# Altium schematic sheet AUDIO_1.SchDoc: Air724UG 参考设计
size 594 x 419 mm; DESIGNER: Loukanghua; REV: V1.0
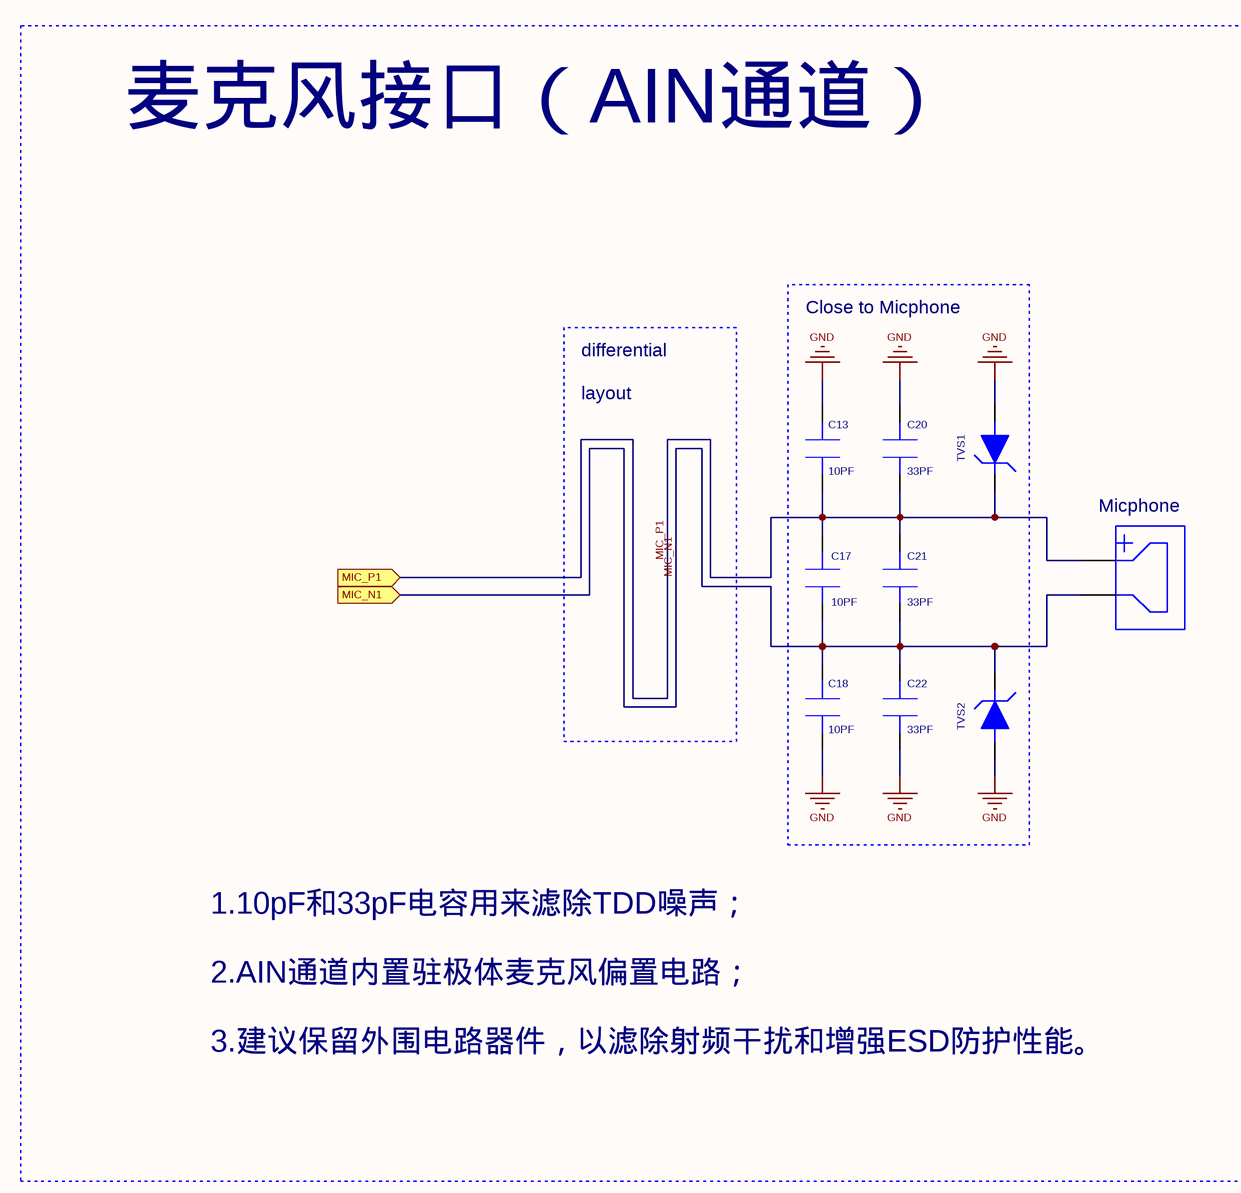
[diagram p0: AUDIO_1.SchDoc, top left]
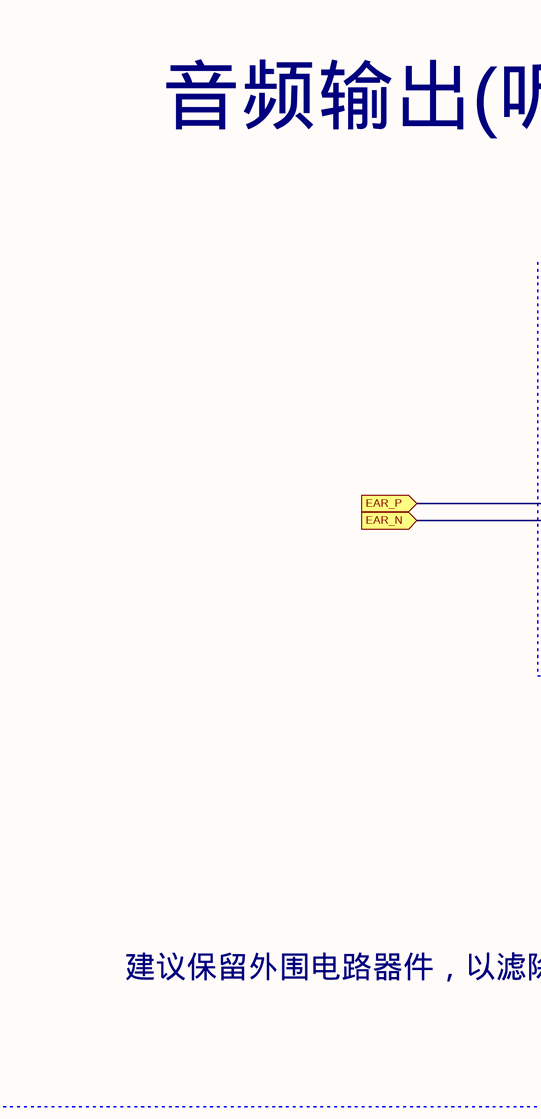
[diagram p1: AUDIO_1.SchDoc, top middle]
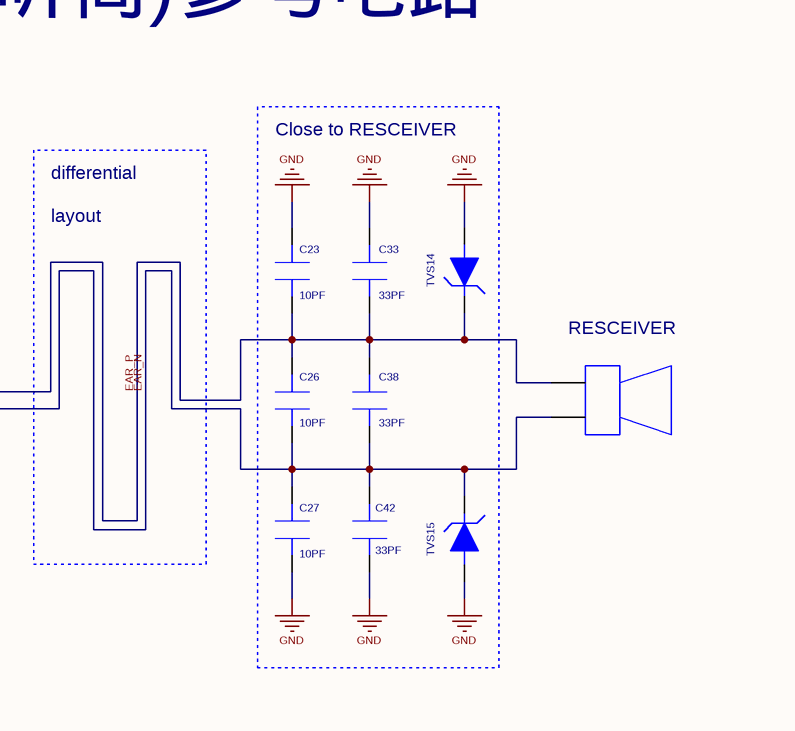
[diagram p2: AUDIO_1.SchDoc, top right]
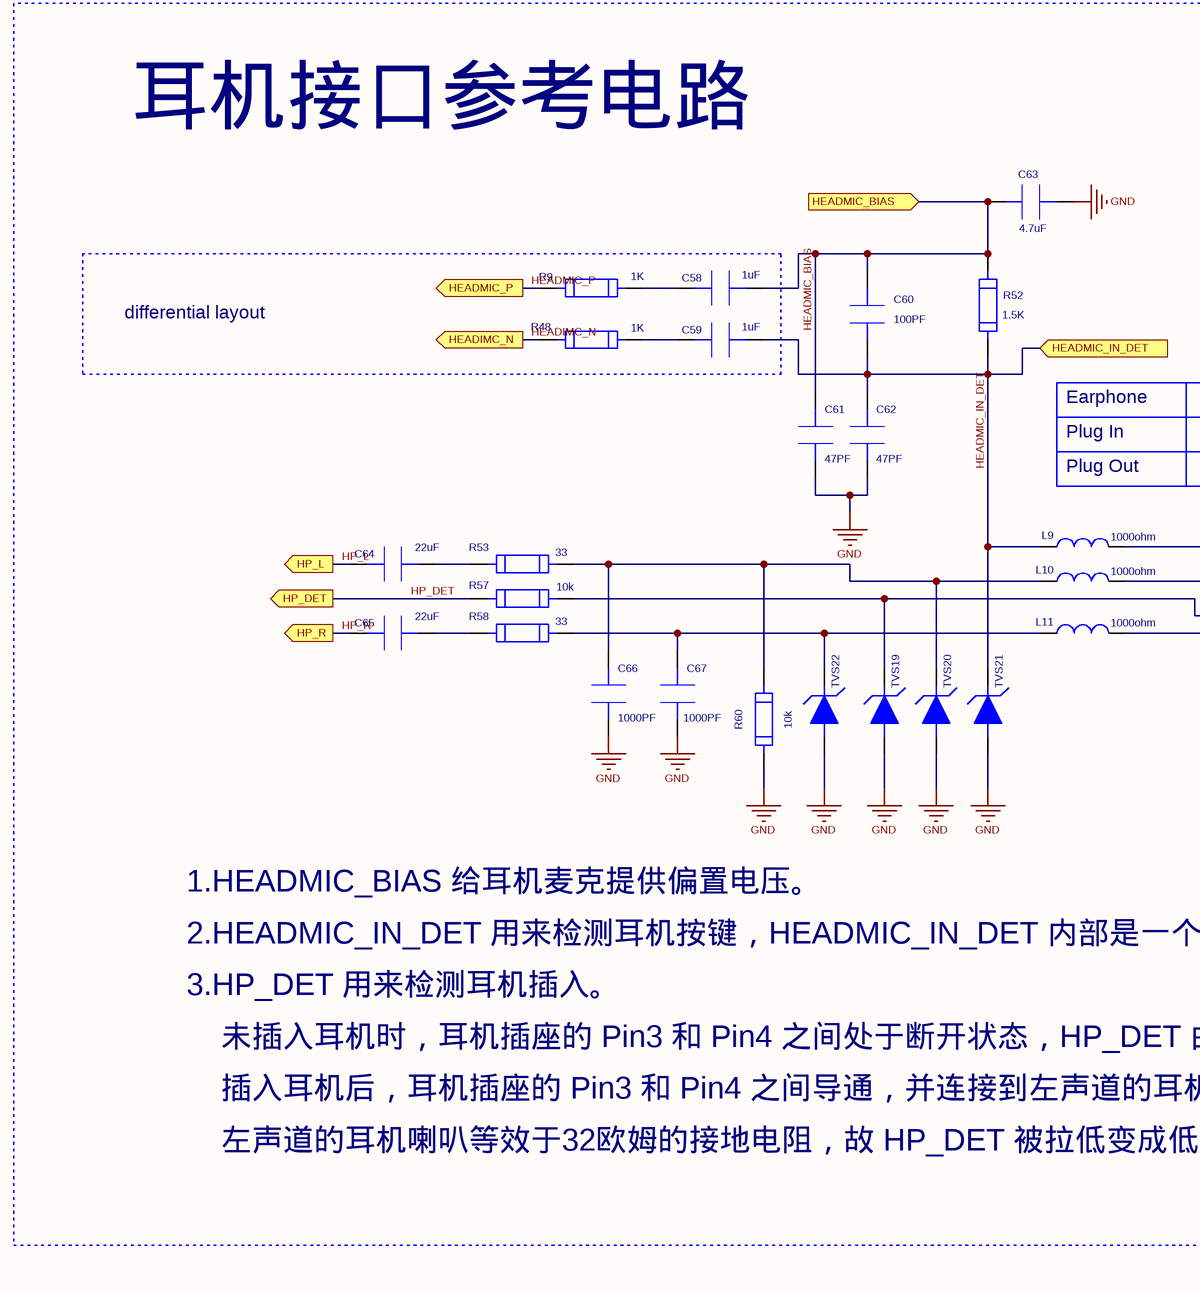
[diagram p3: AUDIO_1.SchDoc, bottom left]
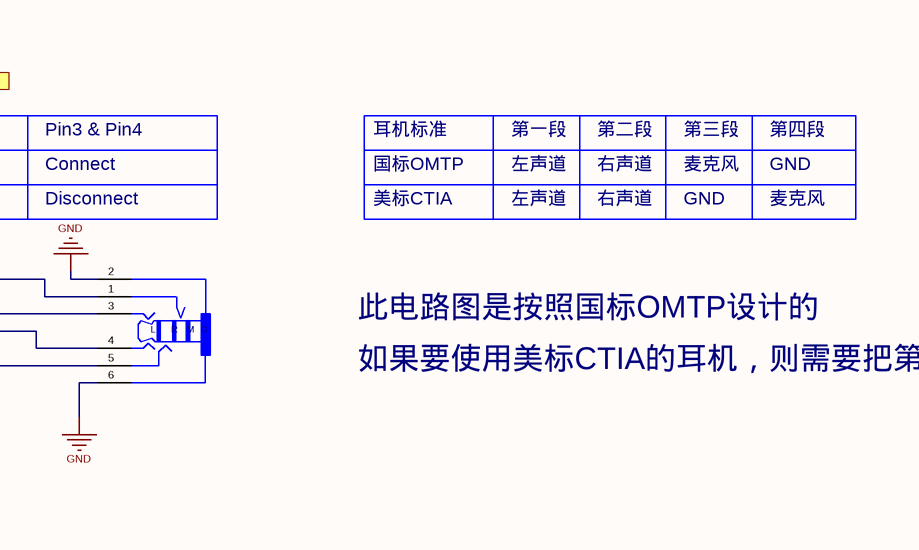
[diagram p4: AUDIO_1.SchDoc, bottom middle]
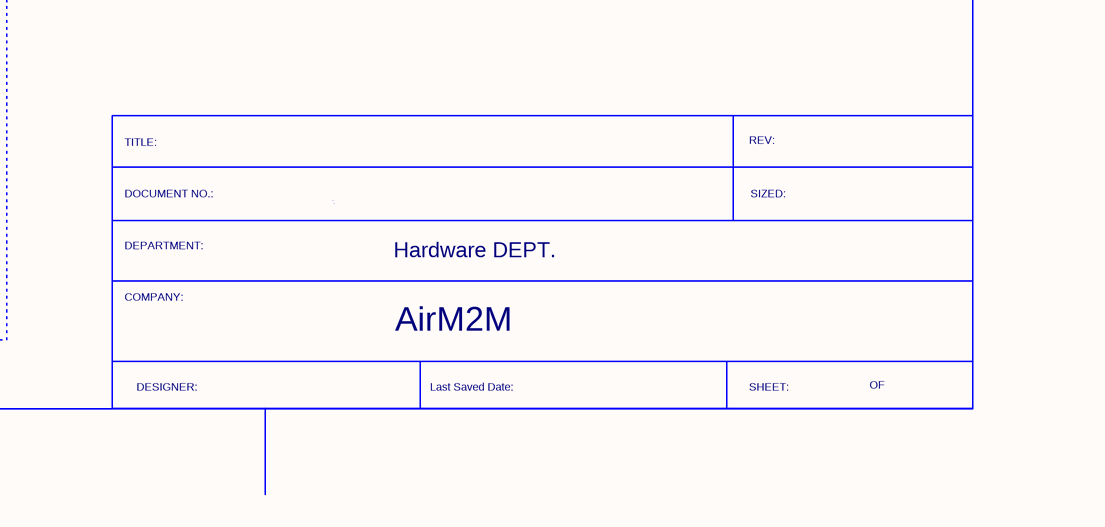
[diagram p5: AUDIO_1.SchDoc, bottom right]

## Parts
C13  value 10PF  [SC0201]  (hidden comment: CAP-10PF-0201-COG)
C17  value 10PF  [SC0201]  (hidden comment: CAP-10PF-0201-COG)
C18  value 10PF  [SC0201]  (hidden comment: CAP-10PF-0201-COG)
C20  value 33PF  [SC0201]  (hidden comment: CAP-10PF-0201-COG)
C21  value 33PF  [SC0201]  (hidden comment: CAP-10PF-0201-COG)
C22  value 33PF  [SC0201]  (hidden comment: CAP-10PF-0201-COG)
C23  value 10PF  [SC0201]  (hidden comment: CAP-10PF-0201-COG)
C26  value 10PF  [SC0201]  (hidden comment: CAP-10PF-0201-COG)
C27  value 10PF  [SC0201]  (hidden comment: CAP-10PF-0201-COG)
C33  value 33PF  [SC0201]  (hidden comment: CAP-10PF-0201-COG)
C38  value 33PF  [SC0201]  (hidden comment: CAP-10PF-0201-COG)
C42  value 33PF  [SC0201]  (hidden comment: CAP-10PF-0201-COG)
C58  value 1uF  [SC0402]  (hidden comment: CAP-1UF-0402-X5R)
C59  value 1uF  [SC0402]  (hidden comment: CAP-1UF-0402-X5R)
C60  value 100PF  [SC0402]  (hidden comment: CAP-100PF-0402-C0G)
C61  value 47PF  [SC0402]  (hidden comment: CAP-47PF-0402-C0G)
C62  value 47PF  [SC0402]  (hidden comment: CAP-47PF-0402-C0G)
C63  value 4.7uF  [SC0402]  (hidden comment: CAP-4.7UF-6.3V-0402)
C64  value 22uF  [SC0402]  (hidden comment: CAP-10UF-6.3V-0402)
C65  value 22uF  [SC0402]  (hidden comment: CAP-10UF-6.3V-0402)
C66  value 1000PF  [SC0402]  (hidden comment: CAP-1000PF-0402-X7R)
C67  value 1000PF  [SC0402]  (hidden comment: CAP-1000PF-0402-X7R)
J3  AUDIO-SUGGEST-1  [AUDIO-EAR-DA0635180-1208-A]  (value not drawn)
J5  AUDIO-SPEAKER-BLUEHY  [CON2-2]  (value not drawn)
L9  value 1000ohm  [SL0402]  (hidden comment: BEAD-1000OHM-0402)
L10  value 1000ohm  [SL0402]  (hidden comment: BEAD-1000OHM-0402)
L11  value 1000ohm  [SL0402]  (hidden comment: BEAD-1000OHM-0402)
M1  AUDIO-MIC-BLUEHY  [CON2-2/3]  (value not drawn)
R9  value 1K  [SR0402]  (hidden comment: RES-1K-0402)
R48  value 1K  [SR0402]  (hidden comment: RES-1K-+-1%-0402)
R52  value 1.5K  [SR0402]  (hidden comment: RES-1.2K-0402)
R53  value 33  [SR0402]  (hidden comment: RES-33-0402)
R57  value 10k  [SR0402]  (hidden comment: RES-10K-0402)
R58  value 33  [SR0402]  (hidden comment: RES-33-0402)
R60  value 10k  [SR0402]  (hidden comment: RES-10K-0402)
TVS1  ESD-TVS-ESD9X5.0ST5G  [SOD-923-ESD9X5.0ST5G]  (value not drawn)
TVS2  ESD-TVS-ESD9X5.0ST5G  [SOD-923-ESD9X5.0ST5G]  (value not drawn)
TVS14  ESD-TVS-ESD9X5.0ST5G  [SOD-923-ESD9X5.0ST5G]  (value not drawn)
TVS15  ESD-TVS-ESD9X5.0ST5G  [SOD-923-ESD9X5.0ST5G]  (value not drawn)
TVS19  ESD-TVS-ESD5Z5.0T1_A  [SOD523(ESD5Z5.0T1)]  (value not drawn)
TVS20  ESD-TVS-ESD5Z5.0T1_A  [SOD523(ESD5Z5.0T1)]  (value not drawn)
TVS21  ESD-TVS-ESD5Z5.0T1_A  [SOD523(ESD5Z5.0T1)]  (value not drawn)
TVS22  ESD-TVS-ESD5Z5.0T1_A  [SOD523(ESD5Z5.0T1)]  (value not drawn)

## Blocks framed on the sheet
麦克风接口（AIN通道）: M1
音频输出(听筒)参考电路: J5
Close to Micphone: C13 C17 C18 C20-C22 TVS1 TVS2
Close to RESCEIVER: C23 C26 C27 C33 C38 C42 TVS14 TVS15
耳机接口参考电路: C60-C67 J3 L9-L11 R52 R53 R57 R58 R60 TVS19-TVS22
differential layout: C58 C59 R9 R48

## Ports
EAR_N, EAR_P, HEADIMC_N (out), HEADMIC_BIAS, HEADMIC_IN_DET, HEADMIC_P (out), HP_DET (out), HP_L (out), HP_R (out), MIC_N1, MIC_P1

## Nets
GND: C13.1 C18.2 C20.1 C22.2 C23.1 C27.2 C33.1 C42.2 C61.2 C62.2 C63.2 C66.2 C67.2 J3.2 J3.6 R60.1 TVS1.2 TVS2.2 TVS14.2 TVS15.2 TVS19.2 TVS20.2 TVS21.2 TVS22.2
EAR_N: C26.2 C27.1 C38.2 C42.1 J5.2 TVS15.1 ; port EAR_N
EAR_P: C23.2 C26.1 C33.2 C38.1 J5.1 TVS14.1 ; port EAR_P
HEADIMC_N: R48.1 ; port HEADIMC_N
HEADMIC_BIAS: C58.2 C60.1 C61.1 C63.1 R52.2 ; port HEADMIC_BIAS
HEADMIC_IN_DET: C59.2 C60.2 C62.1 L9.1 R52.1 TVS21.1 ; port HEADMIC_IN_DET
HEADMIC_P: R9.1 ; port HEADMIC_P
HP_DET: R57.1 ; port HP_DET
HP_L: C64.1 ; port HP_L
HP_R: C65.1 ; port HP_R
MIC_N1: C17.2 C18.1 C21.2 C22.1 M1.2 TVS2.1 ; port MIC_N1
MIC_P1: C13.2 C17.1 C20.2 C21.1 M1.1 TVS1.1 ; port MIC_P1
NetC58_1: C58.1 R9.2
NetC59_1: C59.1 R48.2
NetC64_2: C64.2 R53.1
NetC65_2: C65.2 R58.1
NetC66_1: C66.1 L10.1 R53.2 R60.2 TVS20.1
NetC67_1: C67.1 L11.1 R58.2 TVS22.1
NetJ3_1: J3.1 L9.2
NetJ3_3: J3.3 L10.2
NetJ3_4: J3.4 R57.2 TVS19.1
NetJ3_5: J3.5 L11.2

## Notes on the sheet
- differential
- layout
- (near M1) Micphone
- (near J5) RESCEIVER
- 1.10pF和33pF电容用来滤除TDD噪声；
- 2.AIN通道内置驻极体麦克风偏置电路；
- 3.建议保留外围电路器件，以滤除射频干扰和增强ESD防护性能。
- 建议保留外围电路器件，以滤除射频干扰和增强ESD防护性能。
- Earphone
- Pin3 & Pin4
- 耳机标准
- 第一段
- 第二段
- 第三段
- 第四段
- Plug In
- Plug Out
- Connect
- Disconnect
- 国标OMTP
- 美标CTIA
- 左声道
- 右声道
- 麦克风
- GND
- 此电路图是按照国标OMTP设计的
- 如果要使用美标CTIA的耳机，则需要把第3段、第4段的接线对换一下。
- 1.HEADMIC_BIAS 给耳机麦克提供偏置电压。
- 2.HEADMIC_IN_DET 用来检测耳机按键，HEADMIC_IN_DET 内部是一个ADC，故 HEADMIC_IN_DET 还可以支持多功能按键。
- 3.HP_DET 用来检测耳机插入。
- 未插入耳机时，耳机插座的 Pin3 和 Pin4 之间处于断开状态，HP_DET 由内部拉高，为高电平。
- TITLE:
- REV:
- 插入耳机后，耳机插座的 Pin3 和 Pin4 之间导通，并连接到左声道的耳机喇叭。
- 左声道的耳机喇叭等效于32欧姆的接地电阻，故 HP_DET 被拉低变成低电平。
- DEPARTMENT:
- DOCUMENT NO.:
- Hardware DEPT.
- SIZED:
- COMPANY:
- AirM2M
- DESIGNER:
- Last Saved Date:
- SHEET:
- OF
- (in symbol AUDIO-SUGGEST-1) L; R; M; G

## Library data of the parts
C13 C17 C18 C20-C23 C26 C27 C33 C38 C42 = CAP-10PF-0201-COG: CAP CER C0G;10PF;+/-5%;25V;0201;0.35mm;ROHS; Manufacture 1: Eyang;; Manufacture 1 P/N: C0201C0G100J250NT; Serial Number: 80212640006; Geometry.Height: 0.35mm; Tolerance: +/-5%; PCB DECAL: SC0201
C58 C59 = CAP-1UF-0402-X5R: CAP CER X5R;1uF;+/-10%;6.3V;0402;0.5mm;ROHS; Manufacture 1 P/N: GRM155R60J105K****;CC0402KRX5R5BB105;C1005X5R0J105KT;JMK105BJ105KV-F;ECJ0EB0J105K;0402X105K6R3CT;CL05A105KQ5NNNC; Manufacture 1: Murata;Yageo;TDK;Taiyo Yuden;Panasonic;Walsin;Samsung; Serial Number: 80214710001; Geometry.Height: 0.55mm; Tolerance: +/-10%; PCB DECAL: SC0402
C60 = CAP-100PF-0402-C0G: CAP CER C0G;100PF;+/-5%;50V;0402;0.5mm;ROHS; Manufacture 1: MURATA;TDK;Yageo;Walsin;Eyang; Manufacture 1 P/N: GRM1555C1H101J****;C1005C0G1H101J;CC0402JRNP09BN101;0402N101J500CT;C0402C0G101J500N*; Geometry.Height: 0.55mm; Serial Number: 80214650002; Tolerance: +/-5%; PCB DECAL: SC0402
C61 C62 = CAP-47PF-0402-C0G: CAP CER C0G;47PF;+/-5%;50V;0402;0.5mm;ROHS; Manufacture 1: Murata;Yageo;Walsin;Eyang; Manufacture 1 P/N: GRM1555C1H470J****;CC0402JRNPO9BN470;0402N470J500CT;C0402C0G470J500N*; Geometry.Height: 0.55mm; Serial Number: 80214650005; Tolerance: +/-5%; PCB DECAL: SC0402
C63 = CAP-4.7UF-6.3V-0402: CAP CER;4.7uF;20%;6.3V;0402; Manufacture 1: MURATA; Manufacture 1 P/N: GRM155R60J475ME47D; Priority: 1; Geometry.Height: 0.60mm; Serial Number: 31201001402; Tolerance: +/-20%; Update Time: 2014-11-11; PCB DECAL: SC0402
C64 C65 = CAP-10UF-6.3V-0402: CAP CER;10uF;20%;6.3V; Manufacture 1: MURATA; Manufacture 1 P/N: GRM155R60J106ME11D; Priority: 1; Geometry.Height: 0.70mm; Serial Number: 31201001523; Tolerance: +/-20%; DataSheet: Z:\DATASHEET\CAP\MURATA_GRM155R60J106ME11D.PDF; Update Time: 2016-06-29; PCB DECAL: SC0402
C66 C67 = CAP-1000PF-0402-X7R: CAP CER X7R;1000PF;+/-10%;50V;0402;0.5mm;ROHS; Manufacture 1: MURATA;Yageo;Walsin;Eyang; Manufacture 1 P/N: GRM155R71H102K****;CC0402KRX7R9BB102;0402B102K500CT;C0402X7R102K500N*; Geometry.Height: 0.55mm; Serial Number: 80214750001; Tolerance: +/-10%; PCB DECAL: SC0402
J3 = AUDIO-SUGGEST-1: 耳机座; PCB DECAL: AUDIO-EAR-DA0635180-1208-A
L9-L11 = BEAD-1000OHM-0402: Bead;1000ohm;250mA;0402;0.6mm;ROHS; Manufacture 1: Murata;Taiyo Yuden;Chilisin(奇力新)();; Manufacture 1 P/N: BLM15HD102SN1;BK1005HS102-T;SBJ100505T-102Y-N; Geometry.Height: 0.65mm; Serial Number: 80334000002; PCB DECAL: SL0402
R9 = RES-1K-0402: RES FILM;1K;+/-5%;1/16W;0402;0.4mm;ROHS; Manufacture 1: YAGEO;Walsin; Manufacture 1 P/N: RC0402JR-071KL;WR04X102_JTL; Geometry.Height: 0.40mm; Serial Number: 80114640003; Tolerance: +/-5%; PCB DECAL: SR0402
R48 = RES-1K-+-1%-0402: RES FILM;1K;+/-1%;1/16W;0402;0.4mm;ROHS; Manufacture 1: YAGEO; Manufacture 1 P/N: RC0402FR-071KL; Serial Number: 80114440035; Geometry.Height: 0.4mm; Tolerance: +/-1%; PCB DECAL: SR0402
R52 = RES-1.2K-0402: RES FILM;1.2k;+/-5%;1/16W;0402;0.4mm;ROHS; Manufacture 1: YAGEO; Manufacture 1 P/N: RC0402JR-071K2L; Geometry.Height: 0.40mm; Serial Number: 80114640057; Tolerance: 5%; PCB DECAL: SR0402
R53 R58 = RES-33-0402: RES FILM;33;+/-5%;1/16W;0402;0.4mm;ROHS; Manufacture 1 P/N: RC0402JR-0733RL; Manufacture 1: YAGEO; Serial Number: 80114640011; Geometry.Height: 0.4mm; Tolerance: +/-5%; PCB DECAL: SR0402
R57 R60 = RES-10K-0402: RES FILM;10K;+/-5%;1/16W;0402;0.4mm;ROHS; Manufacture 1 P/N: RC0402JR-0710KL;WR04X103_JTL; Manufacture 1: YAGEO;Walsin; Serial Number: 80114640004; Geometry.Height: 0.4mm; Tolerance: +/-5%; PCB DECAL: SR0402
TVS1 TVS2 TVS14 TVS15 = ESD-TVS-ESD9X5.0ST5G: TVS;5.0V;65PF;SOD?923;ROHS; Manufacture 1: ONSEMI; Geometry.Height: 0.43mm; Serial Number: 81121000001; Manufacture 1 P/N: ESD9X5.0ST5G; PCB DECAL: SOD-923-ESD9X5.0ST5G
TVS19-TVS22 = ESD-TVS-ESD5Z5.0T1_A: TVS;5V;80pF;SOD-523;ROHS; Manufacture 1 P/N: ESD5Z5V-2/TR;PESD5Z5.0;UM5055; Manufacture 1: Will(韦尔);Nxp;Union;; Geometry.Height: 0.7mm; Serial Number: 81100000002; PCB DECAL: SOD523(ESD5Z5.0T1)
J5 = AUDIO-SPEAKER-BLUEHY: PCB DECAL: CON2-2
M1 = AUDIO-MIC-BLUEHY: PCB DECAL: CON2-2/3